# EAGLE design 3-Pumps-Driver (EAGLE 9.6.2)
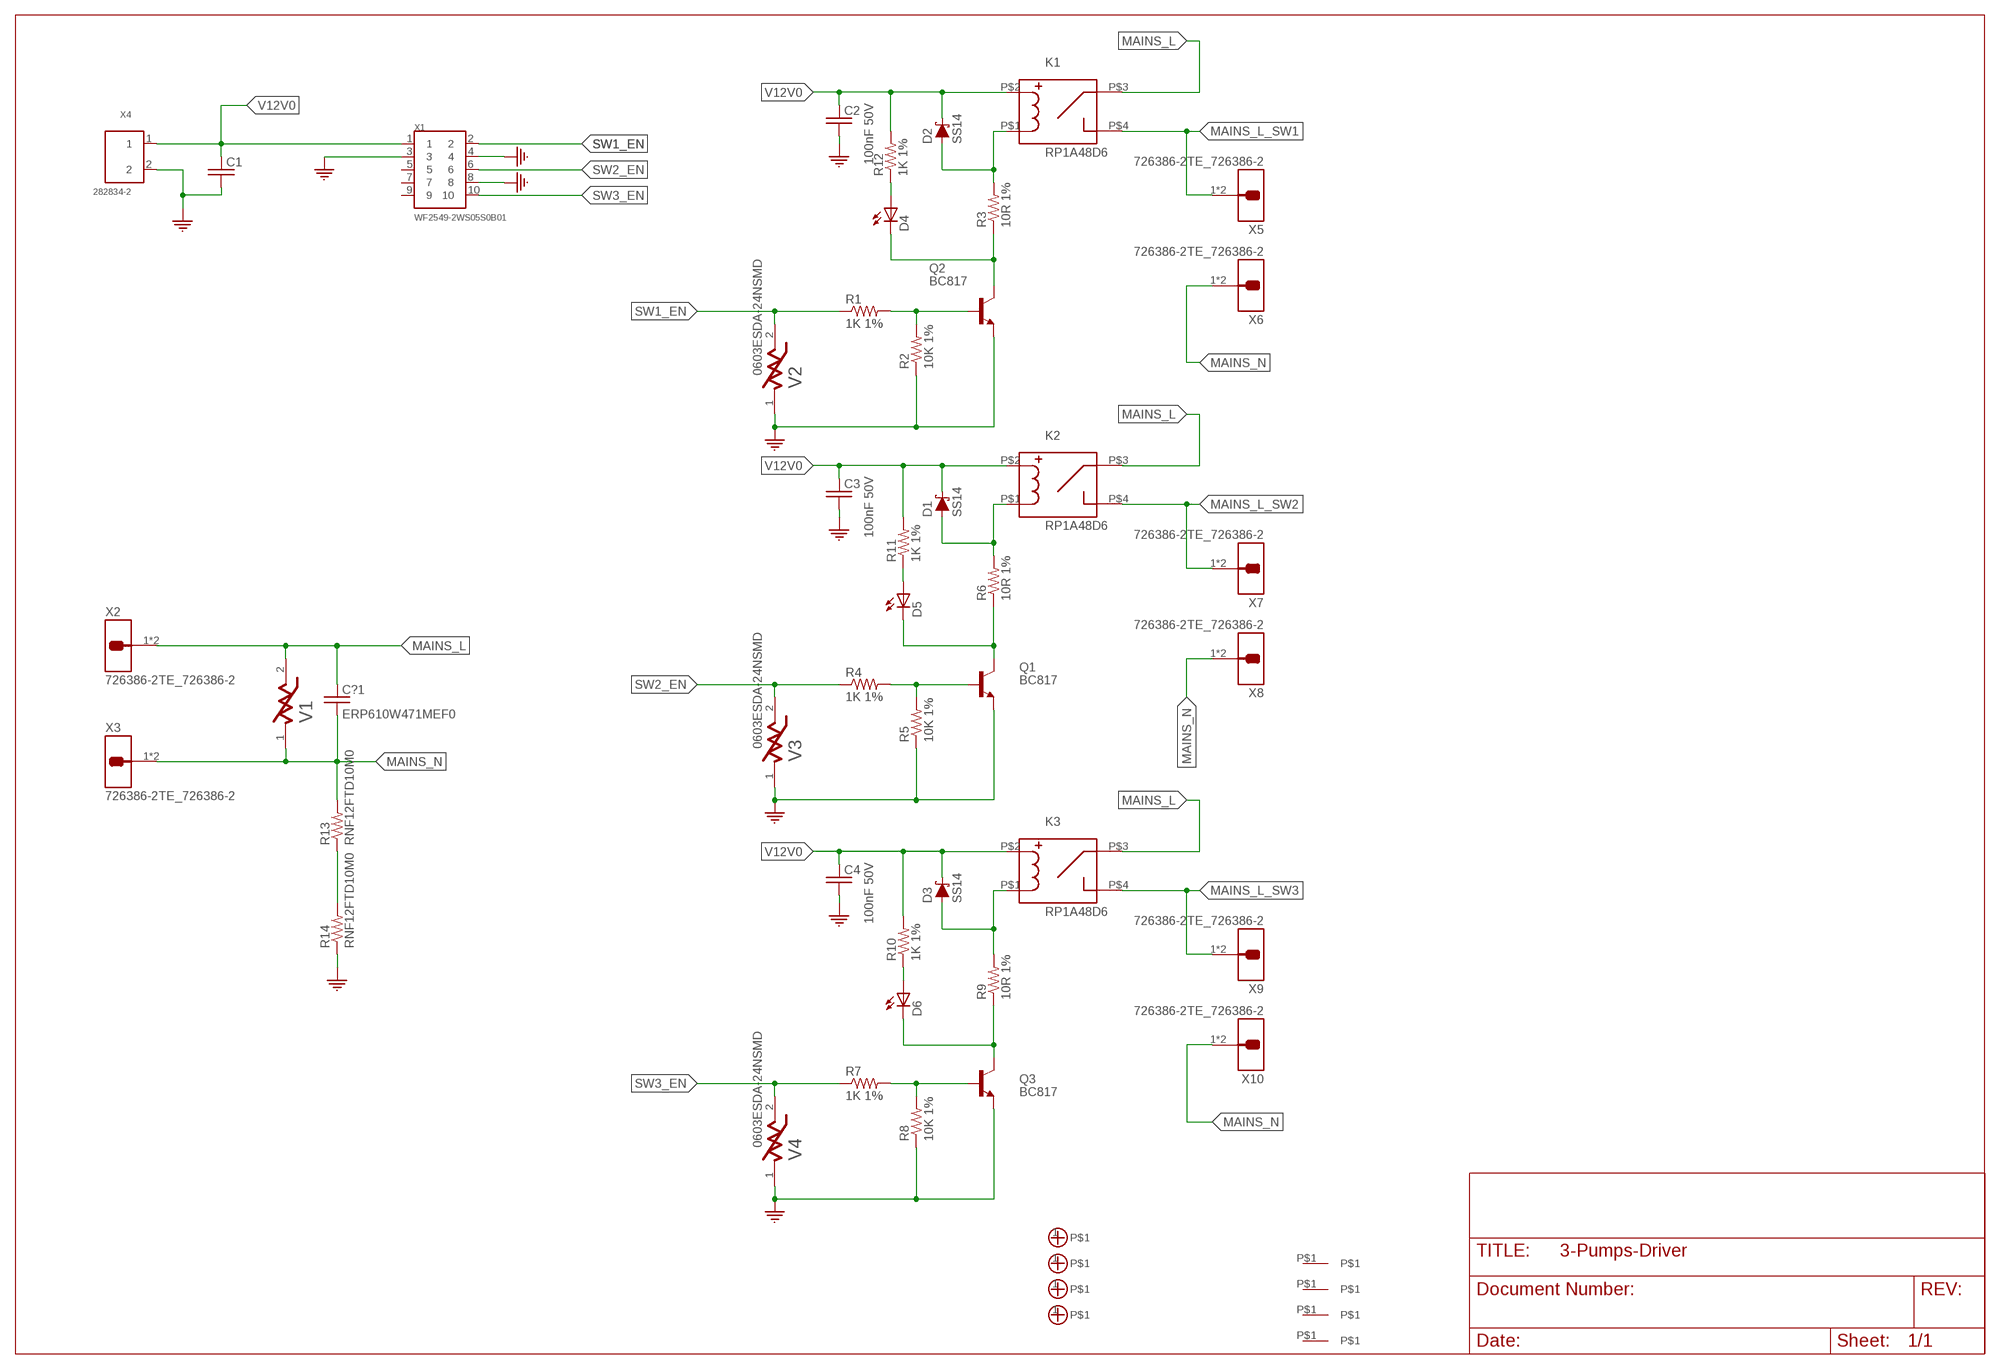
[diagram p0: schematic, sheet 1]

## Parts
C1  C_0603EIA0603  [EIA0603]
C2  100nF 50V  C_0603EIA0603  [EIA0603]
C3  100nF 50V  C_0603EIA0603  [EIA0603]
C4  100nF 50V  C_0603EIA0603  [EIA0603]
C?1  ERP610W471MEF0  [CAPACITOR-FILM-RM12.5MM-12MM]
D1  SS14  [SMA]
D2  SS14  [SMA]
D3  SS14  [SMA]
D4  26-21/GPC-F3138B/CA  [SMD1206-LED]
D5  26-21/GPC-F3138B/CA  [SMD1206-LED]
D6  26-21/GPC-F3138B/CA  [SMD1206-LED]
FID1  FIDUCIAL  [FIDUCIAL]
FID2  FIDUCIAL  [FIDUCIAL]
FID3  FIDUCIAL  [FIDUCIAL]
FID4  FIDUCIAL  [FIDUCIAL]
K1  RP1A48D6  [SSR_RP1A]
K2  RP1A48D6  [SSR_RP1A]
K3  RP1A48D6  [SSR_RP1A]
M1  M_HOLE_3M  [PCB_SCREW_M3_POWER]
M2  M_HOLE_3M  [PCB_SCREW_M3_POWER]
M3  M_HOLE_3M  [PCB_SCREW_M3_POWER]
M4  M_HOLE_3M  [PCB_SCREW_M3_POWER]
Q1  BC817  [SOT23]
Q2  BC817  [SOT23]
Q3  BC817  [SOT23]
R1  1K 1%  R_0603  [EIA0603]
R2  10K 1%  R_0603  [EIA0603]
R3  10R 1%  R_1206EIA1206  [EIA1206]
R4  1K 1%  R_0603  [EIA0603]
R5  10K 1%  R_0603  [EIA0603]
R6  10R 1%  R_1206EIA1206  [EIA1206]
R7  1K 1%  R_0603  [EIA0603]
R8  10K 1%  R_0603  [EIA0603]
R9  10R 1%  R_1206EIA1206  [EIA1206]
R10  1K 1%  R_1206EIA1206  [EIA1206]
R11  1K 1%  R_1206EIA1206  [EIA1206]
R12  1K 1%  R_1206EIA1206  [EIA1206]
R13  RNF12FTD10M0  [RES-RM12.5-VR37]
R14  RNF12FTD10M0  [RES-RM12.5-VR37]
V1  B72205S0271K101B72205S2131K101  [EPCOS_B72205S0271K101_0]
V2  0603ESDA-24NSMD  [EIA0603]
V3  0603ESDA-24NSMD  [EIA0603]
V4  0603ESDA-24NSMD  [EIA0603]
X1  WF2549-2WS05S0B01  [X10_100MIL_2XROW_VERT]
X2  726386-2TE_726386-2  [TE_726386-2]
X3  726386-2TE_726386-2  [TE_726386-2]
X4  282834-2  [TE_282834-2_0]
X5  726386-2TE_726386-2  [TE_726386-2]
X6  726386-2TE_726386-2  [TE_726386-2]
X7  726386-2TE_726386-2  [TE_726386-2]
X8  726386-2TE_726386-2  [TE_726386-2]
X9  726386-2TE_726386-2  [TE_726386-2]
X10  726386-2TE_726386-2  [TE_726386-2]

## Nets
GND: C1.2 C2.2 C3.2 C4.2 Q1.2(E) Q2.2(E) Q3.2(E) R2.1 R5.1 R8.1 R14.1 V2.1 V3.1 V4.1 X1.3 X1.4 X1.8 X4.2
MAINS_L: C?1.1 K1.P$3 K2.P$3 K3.P$3 V1.2 X2.1 X2.1-2
MAINS_L_SW1: K1.P$4 X5.1 X5.1-2
MAINS_L_SW2: K2.P$4 X7.1 X7.1-2
MAINS_L_SW3: K3.P$4 X9.1 X9.1-2
MAINS_N: C?1.2 R13.2 V1.1 X3.1 X3.1-2 X6.1 X6.1-2 X8.1 X8.1-2 X10.1 X10.1-2
N$1: D4.1(A) R12.1
N$2: Q2.1(B) R1.2 R2.2
N$3: Q1.1(B) R4.2 R5.2
N$4: D2.2(A) K1.P$1 R3.2
N$5: D1.2(A) K2.P$1 R6.2
N$6: D5.1(A) R11.1
N$7: D4.2(C) Q2.3(C) R3.1
N$8: D5.2(C) Q1.3(C) R6.1
N$9: Q3.1(B) R7.2 R8.2
N$10: D3.2(A) K3.P$1 R9.2
N$11: D6.1(A) R10.1
N$12: R13.1 R14.2
N$13: D6.2(C) Q3.3(C) R9.1
SW1_EN: R1.1 V2.2 X1.2
SW2_EN: R4.1 V3.2 X1.6
SW3_EN: R7.1 V4.2 X1.10
V12V0: C1.1 C2.1 C3.1 C4.1 D1.1(C) D2.1(C) D3.1(C) K1.P$2 K2.P$2 K3.P$2 R10.2 R11.2 R12.2 X1.1 X4.1
Unconnected: FID1.P$1 FID2.P$1 FID3.P$1 FID4.P$1 M1.1 M2.1 M3.1 M4.1 X1.5 X1.7 X1.9

## Library data of the parts
C1-C4 = Labops_Lib_AH:C_0603
C?1 = Labops_Lib_AH:ERP610W471MEF0; DESCRIPTION: 470pF ±20% 760V Ceramic Capacitor Radial, Y5U, X1,Y1; MFN: ERP610W471MEF0; MFR: Vishay; PART_VALUE: 470pF/760V
D1-D3 = Labops_Lib_AH:SS14; DESCRIPTION: Diode Schottky 1A/40V (SMA); LIB_STATUS: Prototype; MFN: SS14-LTP; MFR: MCC; OUR_STOCK: 10; PART_VALUE: Schottky 1A/40V; PRICE-1: 0.05; SUPPLIER-1: LCSC
D4-D6 = Labops_Lib_AH:26-21/GPC-F3138B/CA; DESCRIPTION: Green SMD LED 1206, 160mcd; LIB_STATUS: Prototype; MFN: 26-21/GPC-F3138B/CA; MFR: Everlight; OUR_STOCK: 50; PART_VALUE: Green LED; PRICE-1: 0.06; SUPPLIER-1: LCSC
FID1-FID4 = Labops_Lib_AH:FIDUCIAL
K1-K3 = Labops_Lib_AH:RP1A48D6
M1-M4 = Labops_Lib_AH:M_HOLE_3M
Q1-Q3 = Labops_Lib_AH:BC817; DESCRIPTION: Transistor BJT NPN SOT23 45V 0.5A; MFN: BC817; MFR: NXP; PRICE-1: 0.03; SUPPLIER-1: Mouser
R1 R2 R4 R5 R7 R8 = Labops_Lib_AH:R_0603; MFN: Open Source 0603
R3 R6 R9-R12 = Labops_Lib_AH:R_1206; MFN: Open Source R1206
R13 R14 = Labops_Lib_AH:RNF12FTD10M0; DESCRIPTION: 10 MOhms ±1% 0.5W, 1/2W Through Hole Resistor Axial Flame Retardant Coating, Safety Metal Film; LIB_STATUS: Prototype; MFN: RNF12FTD10M0; MFR: Stackpole Electronics Inc; OUR-STOCK: 20; PART_VALUE: 10Meg 5%; PRICE-1: 0.29; SUPPLIER-1: Digikey
V1 = Labops_Lib_AH:B72205S0271K101: VARISTOR 205V 800A DISC 5MM; LIB_STATUS: Verified; MFN: B72205S0271K1011; MFR: EPCOS; OUR_STOCK: 10; PART_VALUE: 430V, 400A; PRICE-1: 0.31; SUPPLIER-1: Digikey
V2-V4 = Labops_Lib_AH:0603ESDA-24N; DESCRIPTION: aristor 0603 SMD Bidirectional 50V 24V; MFN: 0603ESDA-24N; MFR: Bourns; SUPPLIER-1: LCSC
X1 = Labops_Lib_AH:WF2549-2WS05S0B01; DESCRIPTION: X10, 10 Pins, Header, Pitch 2.54 wire to board 2xrows, THT; MFN: WF2549-2WS05S0B01; MFR: WCON; PRICE-1: 0.25; SUPPLIER-1: LCSC
X2 X3 X5-X10 = Labops_Lib_AH:726386-2: Terminals, Faston, GDS-Flachstecker 6.3x0.8mm, TE; CENTROID_NOT_SPECIFIED: No; CONN_GENDER: Male; CONN_ORIENTATION: Straight; CONTACT_MATERIAL: Tin; DATASHEET: http://www.te.com/commerce/DocumentDelivery/DDEController?Action=showdoc&DocId=Customer+Drawing%7F726386%7FG%7Fpdf%7FEnglish%7FENG_CD_726386_G.pdf%7F726386-2; DEVICE_CLASS_L1: Connectors; DEVICE_CLASS_L2: Terminal Blocks | Terminals; DEVICE_CLASS_L3: unset; DIGIKEY_DESCRIPTION: CONN QC TAB 0.250 SOLDER; DIGIKEY_PART_NUMBER: A114371-ND; HEIGHT: 10mm; LEAD_FREE: yes; MF: TE; MFG_PACKAGE_IDENT: 726386-2; MFG_PACKAGE_IDENT_DATE: 0; MFG_PACKAGE_IDENT_REV: 0; MOUSER_DESCRIPTION: Terminals GDS-FLACHSTECK 6.3; MOUSER_PART_NUMBER: 571-726386-2; MPN: 726386-2; PACKAGE: PTH_TERMINAL_8MM0_0MM8; PREFIX: J; ROHS: yes; TEMPERATURE_RANGE_HIGH: +110°C; TEMPERATURE_RANGE_LOW: -30°C; VERIFICATION_VERSION: 0.0.0.1
X4 = Labops_Lib_AH:282834-2; DESCRIPTION: Connector Header Terminal Block 2 Positions, 1 Row, 2.54mm, THT; MFN: 282834-2; MFR: TE; PRICE-1: 0.8; SUPPLIER-1: Digikey

## Board
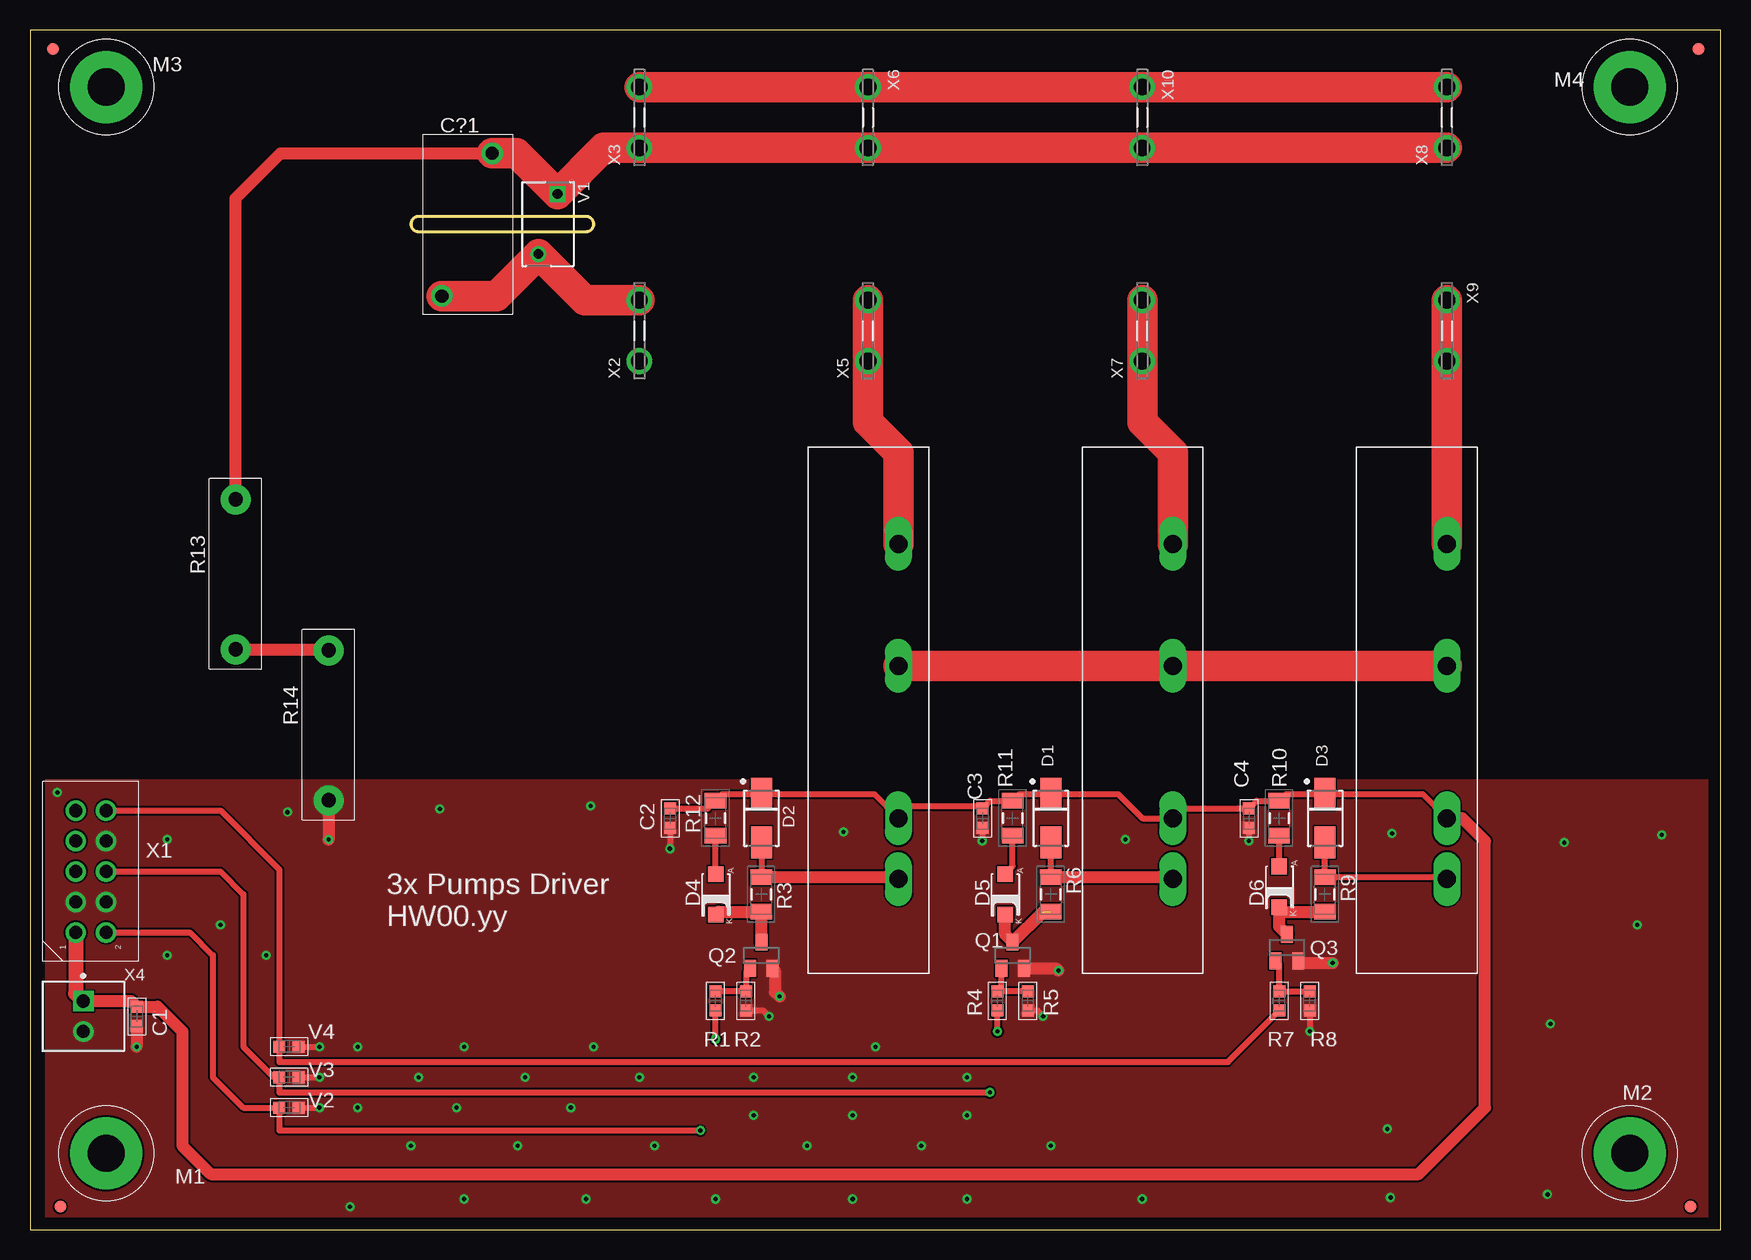
[diagram p1: board, top side]
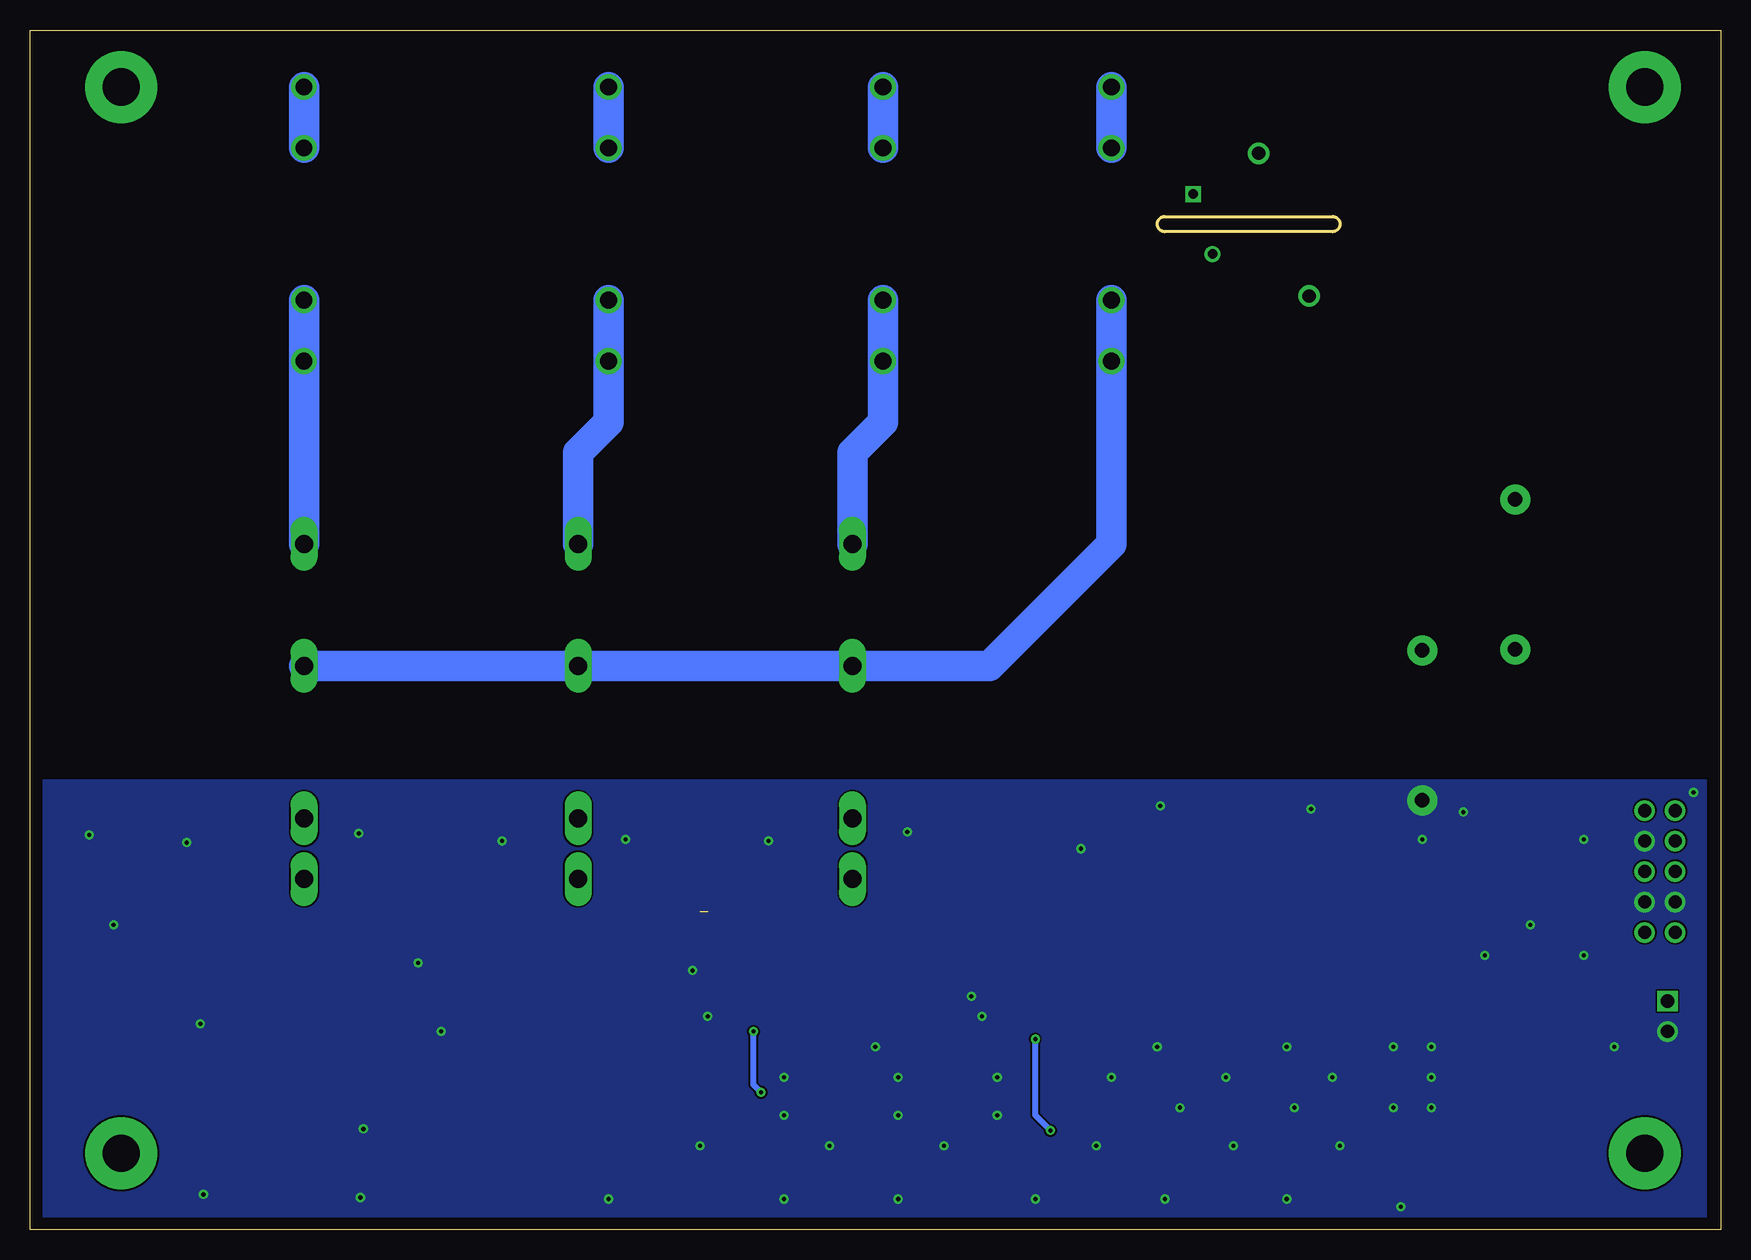
[diagram p2: board, bottom side, seen from below]

Size 140.95 x 100 mm. Coordinates in mm from the lower left corner, seen from the top.
Outline: 0,0 140.95,0 140.95,100 0,100 0,0
Outline: 32.38,83.19 46.35,83.19 arc90 46.99,83.82 arc90 46.35,84.45 32.38,84.45 arc90 31.75,83.82 arc90 32.38,83.19
Copper layers (1*16): Top 0.035mm / dielectric 1.5mm / Bottom 0.035mm
Design rules "default *": minimum track width 6mil, minimum drill 0.35mm, track to track 6mil, track to pad 6mil, pad to pad 6mil, via to via 6mil, smd to smd 6mil, copper to edge 40mil, drill to drill 6mil, minimum pad ring 10mil, minimum via ring 8mil, stop-mask expansion 4mil, vias tented up to drill 1mm, thermal gap 10mil

### Footprints (pad centres in the part's own frame; a part is rotated, then mirrored left to right if it is on the bottom)
EIA0603 = smd 1 x 1: 1 -0.8,0; 2 0.8,0
CAPACITOR-FILM-RM12.5MM-12MM = drill 1.1 pad 1.8: 1 6,-2.5; 2 -5.9,1.7
SMA = smd 2.65 x 1.75: 1 -2.015,0; 2 2.015,0
SMD1206-LED = smd 1.3 x 1.3: 1 -1.7,0; 2 1.7,0
FIDUCIAL = smd 1 x 1: P$1 0,0
SSR_RP1A = drill 1.5 long: P$1 0,0; P$2 -5.08,0; P$3 -17.78,0; P$4 -27.94,0
PCB_SCREW_M3_POWER = drill 3.1 pad 6: 1 0,0
SOT23 = smd 1 x 1.4: 1 -0.95,-1.1; 2 0.95,-1.1; 3 0,1.1
EIA1206 = smd 1.3 x 1.8: 1 -1.45,0; 2 1.45,0
RES-RM12.5-VR37 = drill 1.2 pad 2.5: 1 -6.25,0; 2 6.25,0
EPCOS_B72205S0271K101_0 = drill 0.8 pad 1.3 square: 1 -2.5,0.8 | drill 0.8 pad 1.3: 2 2.5,-0.8
X10_100MIL_2XROW_VERT = drill 1.1 pad 1.7: 1 -5.08,1.27; 2 -5.08,-1.27; 3 -2.54,1.27; 4 -2.54,-1.27; 5 0,1.27; 6 0,-1.27; 7 2.54,1.27; 8 2.54,-1.27; 9 5.08,1.27; 10 5.08,-1.27
TE_726386-2 = drill 1.4 pad 2.15: 1 -2.54,0; 1-2 2.54,0
TE_282834-2_0 = drill 1.1 pad 1.7 square: 1 -1.27,0 | drill 1.1 pad 1.7: 2 1.27,0

### Placement (x,y rotation side)
C1  8.89,17.78 270 top
C2  53.34,34.29 270 top
C3  79.38,34.29 270 top
C4  101.6,34.29 270 top
C?1  36.83,83.82 270 top
D1  85.09,34.29 270 top
D2  60.96,34.29 270 top
D3  107.95,34.29 270 top
D4  57.15,27.94 270 top
D5  81.28,27.94 270 top
D6  104.14,28.57 270 top
FID1  138.43,1.91 0 top
FID2  2.54,1.91 0 top
FID3  139.06,98.42 0 top
FID4  1.91,98.42 0 top
K1  72.39,29.21 270 top
K2  95.25,29.21 270 top
K3  118.11,29.21 270 top
M1  6.35,6.35 0 top
M2  133.35,6.35 0 top
M3  6.35,95.25 0 top
M4  133.35,95.25 0 top
Q1  81.92,22.86 0 top
Q2  60.96,22.86 0 top
Q3  104.78,23.5 0 top
R1  57.15,19.05 90 top
R2  59.69,19.05 90 top
R3  60.96,27.94 90 top
R4  80.64,19.05 90 top
R5  83.19,19.05 90 top
R6  85.09,27.94 90 top
R7  104.14,19.05 90 top
R8  106.68,19.05 90 top
R9  107.95,27.94 90 top
R10  104.14,34.29 90 top
R11  81.92,34.29 90 top
R12  57.15,34.29 90 top
R13  17.14,54.61 90 top
R14  24.89,42.04 90 top
V1  43.18,83.82 270 top
V2  21.59,10.16 180 top
V3  21.59,12.7 180 top
V4  21.59,15.24 180 top
X1  5.08,29.84 90 top
X2  50.8,74.93 90 top
X3  50.8,92.71 90 top
X4  4.45,17.78 270 top
X5  69.85,74.93 90 top
X6  69.85,92.71 270 top
X7  92.71,74.93 90 top
X8  118.11,92.71 90 top
X9  118.11,74.93 270 top
X10  92.71,92.71 270 top

### Tracks (layer width: path | path; a pad name or v marks a point on that pad's centre or on a via)
GND  (via drill 0.35)
  Top 0.508: R2.1 61.12,18.25 v61.59,17.78 | C2.2 v53.34,31.75 | R5.1 83.98,18.25 v84.45,17.78 | C3.2 v79.38,32.38 | R8.1 v106.68,16.51 | C4.2 v101.6,32.38 | V2.1 v24.13,10.16 | V3.1 v24.13,12.7 | V4.1 v24.13,15.24
  Top 1.016: Q3.2 105.89,22.23 v108.58,22.23 | Q1.2 85.56,21.76 v85.72,21.59 | Q2.2 62.1,21.57 62.1,19.81 v62.48,19.43 | C1.2 v8.89,15.24 | R14.1 v24.89,32.51
  other vias: 26.67,1.91 60.33,12.7 78.11,12.7 68.58,12.7 68.58,9.53 60.33,9.53 78.11,9.53 74.3,6.99 64.77,6.99 52.07,6.99 40.64,6.99 31.75,6.99 35.56,10.16 45.09,10.16 41.27,12.7 32.38,12.7 27.3,10.16 27.3,15.24 36.2,15.24 46.99,15.24 50.8,12.7 36.2,2.54 46.35,2.54 57.15,2.54 68.58,2.54 78.11,2.54 70.48,15.24 19.68,22.86 15.88,25.4 11.43,22.86 85.09,6.99 92.71,2.54 113.41,2.67 126.49,2.92 113.16,8.38 126.75,17.14 133.99,25.4 127.89,32.26 136.02,32.89 113.54,33.02 91.31,32.51 67.82,33.15 46.74,35.31 34.16,35.05 21.46,34.8 11.43,32.51 2.29,36.45
  pour Bottom (no thermals): 1.27,37.47 1.27,0.64 140.34,0.64 140.34,37.47
  pour Top (no thermals): 1.27,37.47 1.27,0.64 140.34,0.64 140.34,37.47
MAINS_L
  Top 2.54: C?1.1 38.88,77.82 V1.2 46.23,77.47 X2.1-2 | K1.P$3 K3.P$3
  Bottom 2.54: K3.P$3 K2.P$3 K1.P$3 60.96,46.99 50.8,57.15 X2.1 X2.1-2
MAINS_L_SW1
  Top 2.54: X5.1-2 69.85,67.31 72.39,64.77 K1.P$4
  Bottom 2.54: K1.P$4 72.39,64.77 69.85,67.31 X5.1 X5.1-2
MAINS_L_SW2
  Top 2.54: X7.1-2 X7.1 92.71,67.31 95.25,64.77 K2.P$4
  Bottom 2.54: K2.P$4 95.25,64.77 92.71,67.31 X7.1-2
MAINS_L_SW3
  Top 2.54: X9.1 X9.1-2 K3.P$4
  Bottom 2.54: K3.P$4 X9.1
MAINS_N
  Top 1.016: R13.2 17.14,85.98 20.89,89.72 C?1.2
  Top 2.54: X8.1 X10.1-2 X6.1-2 X3.1 47.83,90.17 V1.1 40.58,89.72 C?1.2 | X3.1-2 X6.1 X10.1 X8.1-2
  Bottom 2.54: X3.1 X3.1-2 | X6.1-2 X6.1 | X10.1-2 X10.1 | X8.1 X8.1-2
N$1
  Top 0.508: D4.1 | D4.1 R12.1
N$2
  Top 0.508: Q2.1 59.69,21.44 R2.2 R1.2
N$3
  Top 0.508: R5.2 R4.2 80.97,20.17 Q1.1
N$4
  Top 0.508: D2.2 R3.2 | R3.2 | K1.P$1 61.14,29.21 R3.2
  Top 1.016: R3.2 72.21,29.39 K1.P$1
N$5
  Top 0.508: R6.2 | R6.2 D1.2
  Top 1.016: R6.2 95.07,29.39 K2.P$1
N$6
  Top 0.508: D5.1 81.92,30.27 R11.1
N$7
  Top 0.508: R3.1
  Top 1.016: Q2.3 | Q2.3 R3.1 57.4,26.49 D4.2
N$8  (1 unrouted)
  Top 1.016: 84.44,26.49 Q1.3 81.28,24.59 D5.2
N$9
  Top 0.508: R8.2 R7.2 104.14,22.08 Q3.1
N$10
  Top 0.508: D3.2 R9.2 117.93,29.39 K3.P$1 | D3.2
N$11
  Top 0.508: D6.1 R10.1 | R10.1
N$12
  Top 1.016: R13.1 24.82,48.36 R14.2
N$13
  Top 1.016: Q3.3 104.14,25.23 D6.2 104.53,26.49 R9.1
SW1_EN  (via drill 0.35)
  Top 0.508: v57.15,15.88 R1.1 | v55.88,8.26 20.79,8.26 V2.2 17.78,10.16 15.24,12.7 15.24,22.86 13.34,24.77 X1.2
  Bottom 0.508: v55.88,8.26 57.15,9.53 v57.15,15.88
SW2_EN  (via drill 0.35)
  Top 0.508: v80.01,11.43 20.79,11.43 V3.2 20.32,12.7 17.78,15.24 17.78,27.94 15.88,29.84 X1.6 | v80.64,16.51 R4.1
  Bottom 0.508: v80.01,11.43 80.64,12.06 v80.64,16.51
SW3_EN
  Top 0.508: R7.1 99.86,13.97 20.79,13.97 V4.2 20.79,30.01 15.88,34.92 X1.10
V12V0
  Top 0.508: K3.P$2 116.09,36.3 D3.1 104.7,36.3 R10.2 102.25,35.74 C4.1 96.52,35.09 96.05,35.09 K2.P$2 92.71,34.29 90.69,36.3 D1.1 82.48,36.3 R11.2 80.03,35.74 79.61,35.33 | C3.1 79.61,35.33 | C2.1 56.5,35.09 R12.2 57.72,36.3 D2.1 70.38,36.3 K1.P$2 73.42,35.33 79.61,35.33
  Top 1.016: K3.P$2 119.38,34.29 121.28,32.38 121.28,10.16 115.73,4.61 15.07,4.61 12.7,6.99 12.7,16.51 10.63,18.58 C1.1 8.42,19.05 X4.1
  Top 1.27: X1.1 3.81,19.68 X4.1

### Text on the board
tNames: 3x Pumps Driver / HW00.yy